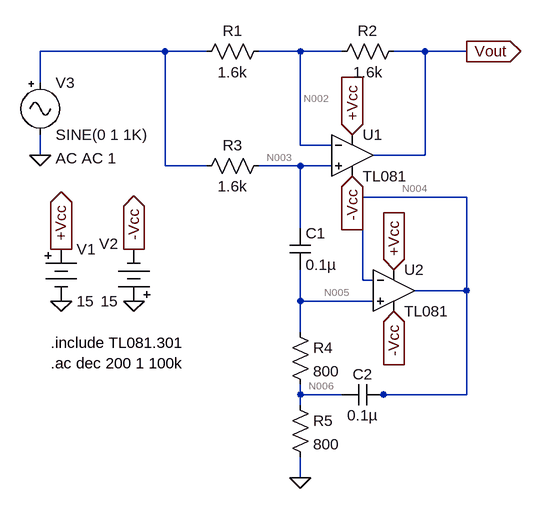
[diagram p0: schematic Simulated Inductor Notch.asc]
Simulated Inductor Notch.asc, the LTspice schematic file:
Version 4
SHEET 1 880 680
WIRE 64 -176 -128 -176
WIRE 128 -176 64 -176
WIRE 272 -176 208 -176
WIRE 336 -176 272 -176
WIRE 464 -176 416 -176
WIRE 528 -176 464 -176
WIRE -128 -128 -128 -176
WIRE 272 -32 272 -176
WIRE 320 -32 272 -32
WIRE -128 -16 -128 -48
WIRE 464 -16 464 -176
WIRE 464 -16 384 -16
WIRE 64 0 64 -176
WIRE 128 0 64 0
WIRE 272 0 208 0
WIRE 320 0 272 0
WIRE 528 48 368 48
WIRE 272 96 272 0
WIRE 368 176 368 48
WIRE 384 176 368 176
WIRE 528 192 528 48
WIRE 528 192 448 192
WIRE 272 208 272 160
WIRE 384 208 272 208
WIRE 272 256 272 208
WIRE 272 352 272 336
WIRE 336 352 272 352
WIRE 400 352 384 352
WIRE 528 352 528 192
WIRE 528 352 400 352
WIRE 272 368 272 352
WIRE 272 480 272 448
FLAG 352 -48 +Vcc
IOPIN 352 -48 In
FLAG 352 16 -Vcc
IOPIN 352 16 In
FLAG -96 128 +Vcc
IOPIN -96 128 Out
FLAG 16 128 -Vcc
IOPIN 16 128 Out
FLAG 16 208 0
FLAG -96 208 0
FLAG -128 -16 0
FLAG 416 160 +Vcc
IOPIN 416 160 In
FLAG 416 224 -Vcc
IOPIN 416 224 In
FLAG 272 480 0
FLAG 528 -176 Vout
IOPIN 528 -176 Out
SYMBOL res 224 -192 R90
WINDOW 0 0 56 VBottom 2
WINDOW 3 32 56 VTop 2
SYMATTR InstName R1
SYMATTR Value 1.6k
SYMBOL res 432 -192 R90
WINDOW 0 0 56 VBottom 2
WINDOW 3 32 56 VTop 2
SYMATTR InstName R2
SYMATTR Value 1.6k
SYMBOL res 224 -16 R90
WINDOW 0 0 56 VBottom 2
WINDOW 3 32 56 VTop 2
SYMATTR InstName R3
SYMATTR Value 1.6k
SYMBOL cap 256 96 R0
SYMATTR InstName C1
SYMATTR Value 0.1µ
SYMBOL OpAmps\\opamp2 352 -80 R0
SYMATTR InstName U1
SYMATTR Value TL081
SYMBOL Misc\\battery -96 112 R0
WINDOW 123 0 0 Left 0
WINDOW 39 0 0 Left 0
SYMATTR InstName V1
SYMATTR Value 15
SYMBOL Misc\\battery 16 224 R180
WINDOW 0 24 104 Left 2
WINDOW 3 24 16 Left 2
WINDOW 123 0 0 Left 0
WINDOW 39 0 0 Left 0
SYMATTR InstName V2
SYMATTR Value 15
SYMBOL Misc\\signal -128 -144 R0
WINDOW 123 24 132 Left 2
WINDOW 39 0 0 Left 0
SYMATTR Value2 AC AC 1
SYMATTR InstName V3
SYMBOL OpAmps\\opamp2 416 128 R0
SYMATTR InstName U2
SYMATTR Value TL081
SYMBOL res 256 240 R0
SYMATTR InstName R4
SYMATTR Value 800
SYMBOL res 256 352 R0
SYMATTR InstName R5
SYMATTR Value 800
SYMBOL cap 400 336 R90
WINDOW 0 0 32 VBottom 2
WINDOW 3 32 32 VTop 2
SYMATTR InstName C2
SYMATTR Value 0.1µ
TEXT -112 272 Left 2 !.include TL081.301
TEXT -112 304 Left 2 !.ac dec 200 1 100k

The netlist it stands for:
* Simulated Inductor Notch.asc
R1 N002 N001 1.6k
R2 Vout N002 1.6k
R3 N003 N001 1.6k
C1 N003 N005 0.1µ
XU1 N003 N002 +Vcc -Vcc Vout TL081  ; pins In+ In- V+ V- OUT
V1 +Vcc 0 15
V2 0 -Vcc 15
V3 N001 0 SINE(0 1 1K) AC AC 1
XU2 N005 N004 +Vcc -Vcc N004 TL081  ; pins In+ In- V+ V- OUT
R4 N005 N006 800
R5 N006 0 800
C2 N004 N006 0.1µ
.include TL081.301
.ac dec 200 1 100k
.backanno
.end

* Results of the author's LTspice run, read from the files saved beside the schematic
* Operating Point, zero values left out:
*   V(n002) = 10.9 µV
*   V(vout) = 21.87 µV
*   V(n003) = -72.09 nV
*   V(n005) = -72.09 nV
*   V(-vcc) = -15 V
*   V(+vcc) = 15 V
*   V(n004) = 10.9 µV
*   V(n006) = -36.04 nV
*   I(R1) = 6.812 nA
*   I(R2) = 6.857 nA
*   I(R3) = -45.05 pA
*   I(R4) = -45.05 pA
*   I(R5) = -45.05 pA
*   I(V1) = -28.39 mA
*   I(V2) = -28.39 mA
*   I(V3) = 6.767 nA
*   Ix(u1:1) = 45.05 pA
*   Ix(u1:2) = 45.05 pA
*   Ix(u1:3) = 14.19 mA
*   Ix(u1:4) = -14.19 mA
*   Ix(u1:5) = -6.857 nA
*   Ix(u2:1) = 45.05 pA
*   Ix(u2:2) = 45.05 pA
*   Ix(u2:3) = 14.19 mA
*   Ix(u2:4) = -14.19 mA
*   Ix(u2:5) = -45.05 pA
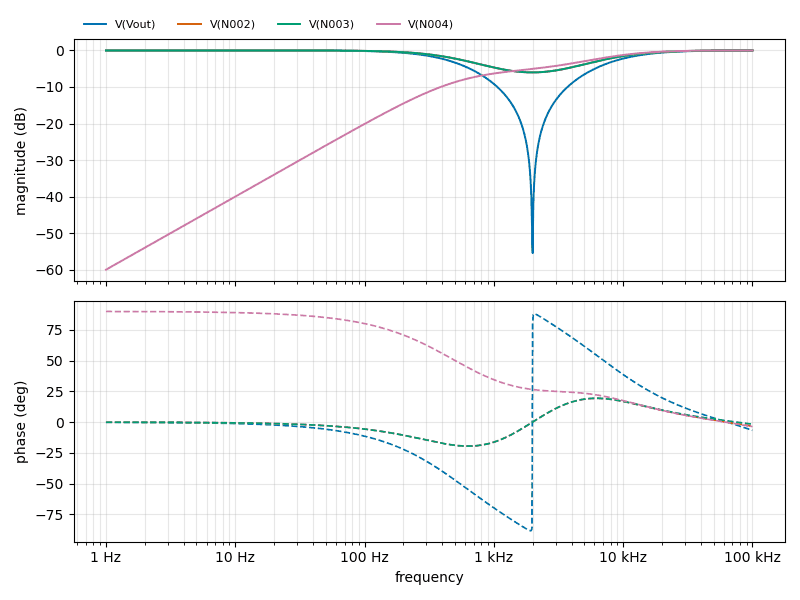
[diagram p1: AC Analysis of Simulated Inductor Notch.asc, plotted from the saved traces]
* AC Analysis, 1 run:
*   V(Vout): -0.00 dB at 1 Hz, -0.01 dB at 100 kHz, peak -0.00 dB at 1 Hz, 3 dB below the peak at 469.6 Hz
*   V(N002): -0.00 dB at 1 Hz, -0.02 dB at 100 kHz, peak -0.00 dB at 1 Hz, 3 dB below the peak at 632.2 Hz
*   V(N003): -0.00 dB at 1 Hz, -0.01 dB at 100 kHz, peak -0.00 dB at 1 Hz, 3 dB below the peak at 632.3 Hz
*   V(N004): -59.95 dB at 1 Hz, -0.01 dB at 100 kHz, peak -0.00 dB at 82.22 kHz, 3 dB below the peak at 4.906 kHz